# Altium schematic sheet OUTPUT.SchDoc
size A4; SheetNumber: 3; SheetTotal: 9
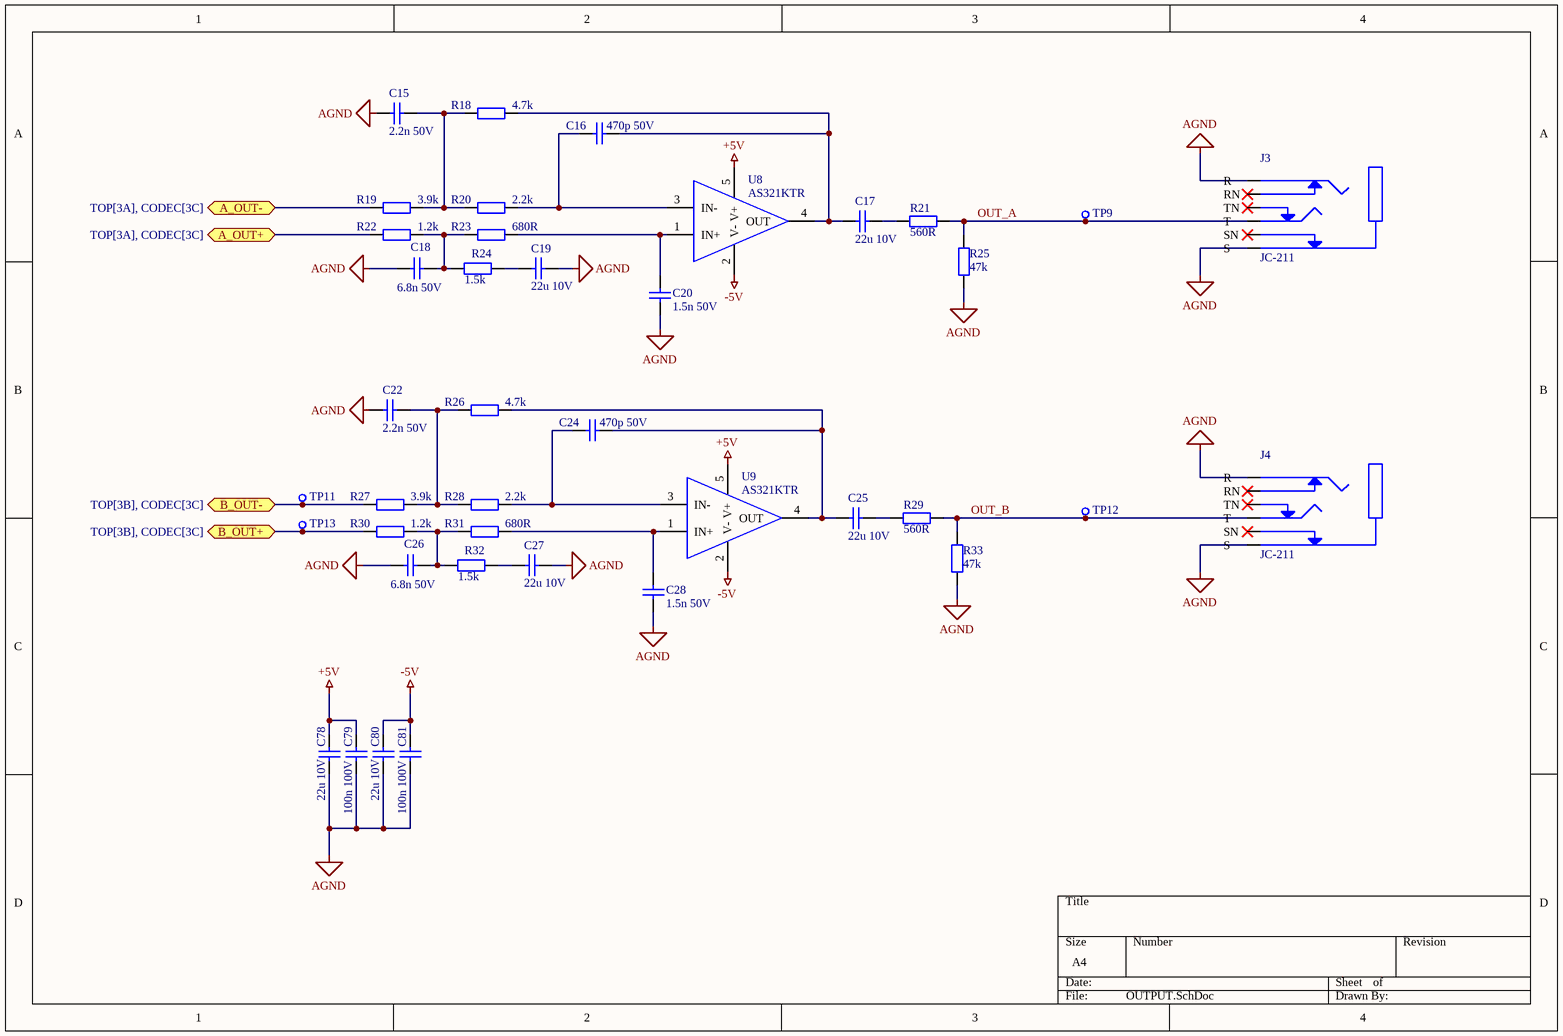
[diagram p0: OUTPUT.SchDoc]

## Parts
C15  2.2n 50V  [CAPACITOR 0805]
C16  470p 50V  [CAPACITOR 0805]
C17  22u 10V  [CAPACITOR 0805]
C18  6.8n 50V  [CAPACITOR 0805]
C19  22u 10V  [CAPACITOR 0805]
C20  1.5n 50V  [CAPACITOR 0805]
C22  2.2n 50V  [CAPACITOR 0805]
C24  470p 50V  [CAPACITOR 0805]
C25  22u 10V  [CAPACITOR 0805]
C26  6.8n 50V  [CAPACITOR 0805]
C27  22u 10V  [CAPACITOR 0805]
C28  1.5n 50V  [CAPACITOR 0805]
C78  22u 10V  [CAPACITOR 0805]
C79  100n 100V  [CAPACITOR 0805]
C80  22u 10V  [CAPACITOR 0805]
C81  100n 100V  [CAPACITOR 0805]
J3  JC-211  [AMPHENOL ACJM-MHDR]
J4  JC-211  [AMPHENOL ACJM-MHDR]
R18  4.7k  [RESISTOR 0805]
R19  3.9k  [RESISTOR 0805]
R20  2.2k  [RESISTOR 0805]
R21  560R  [RESISTOR 0805]
R22  1.2k  [RESISTOR 0805]
R23  680R  [RESISTOR 0805]
R24  1.5k  [RESISTOR 0805]
R25  47k  [RESISTOR 0805]
R26  4.7k  [RESISTOR 0805]
R27  3.9k  [RESISTOR 0805]
R28  2.2k  [RESISTOR 0805]
R29  560R  [RESISTOR 0805]
R30  1.2k  [RESISTOR 0805]
R31  680R  [RESISTOR 0805]
R32  1.5k  [RESISTOR 0805]
R33  47k  [RESISTOR 0805]
TP9  1mm  [TEST POINT 1MM]  (value not drawn)
TP11  1mm  [TEST POINT 1MM]  (value not drawn)
TP12  1mm  [TEST POINT 1MM]  (value not drawn)
TP13  1mm  [TEST POINT 1MM]  (value not drawn)
U8  AS321KTR  [SOT23-5]
U9  AS321KTR  [SOT23-5]

## Ports
A_OUT+ (bidir, see TOP[3A], CODEC[3C]), A_OUT- (bidir, see TOP[3A], CODEC[3C]), B_OUT+ (bidir, see TOP[3B], CODEC[3C]), B_OUT- (bidir, see TOP[3B], CODEC[3C])

## Nets
+5V: C78.2 C79.2 U8.5(V+) U9.5(V+)
-5V: C80.2 C81.2 U8.2(V-) U9.2(V-)
AGND: C15.1 C18.1 C19.2 C20.1 C22.1 C26.1 C27.2 C28.1 C78.1 C79.1 C80.1 C81.1 J3.1(S) J3.2(R) J4.1(S) J4.2(R) R25.1 R33.1
A_OUT+: R22.1 ; port A_OUT+
A_OUT-: R19.1 ; port A_OUT-
B_OUT+: R30.1 TP13.1 ; port B_OUT+
B_OUT-: R27.1 TP11.1 ; port B_OUT-
OUT_A: J3.3(T) R21.2 R25.2 TP9.1
OUT_B: J4.3(T) R29.2 R33.2 TP12.1
NetC15_2: C15.2 R18.1 R19.2 R20.1
NetC16_1: C16.1 R20.2 U8.3(IN-)
NetC16_2: C16.2 C17.1 R18.2 U8.4(OUT)
NetC17_2: C17.2 R21.1
NetC18_2: C18.2 R22.2 R23.1 R24.1
NetC19_1: C19.1 R24.2
NetC20_2: C20.2 R23.2 U8.1(IN+)
NetC22_2: C22.2 R26.1 R27.2 R28.1
NetC24_1: C24.1 R28.2 U9.3(IN-)
NetC24_2: C24.2 C25.1 R26.2 U9.4(OUT)
NetC25_2: C25.2 R29.1
NetC26_2: C26.2 R30.2 R31.1 R32.1
NetC27_1: C27.1 R32.2
NetC28_2: C28.2 R31.2 U9.1(IN+)

Not connected (* = marked no-connect by the designer): J3 4(TN)* 5(RN)* 6(SN)*; J4 4(TN)* 5(RN)* 6(SN)*

## Library data of the parts
C15 C22 = Capacitor 2.2n 50V ±2% X7R 0805: Capacitor: ceramic; MLCC; 2.2nF; 50V; X7R; ±10%; SMD; 0805; Manufacturer: KYOCERA AVX; Manufacturer Part Number: 08055C222KAT2A; ComponentLink1Description: Datasheet; ComponentLink1URL: https://www.tme.eu/Document/78f46414e6dac38b7cca12338ea208b0/X7RDielectric.pdf; Price 10pcs [$]: 0.0680; Supplier: TME
C16 C24 = Capacitor 470p 50V 10% X7R 0805: Capacitor: ceramic; MLCC; 470pF; 50V; X7R; ±10%; SMD; 0805; Manufacturer: KEMET; Manufacturer Part Number: C0805C471K5RAC; ComponentLink1Description: Datasheet; ComponentLink1URL: https://www.tme.eu/Document/8b10290897269af8f8558c697aa8fd11/C0805C471K5RACTU.pdf; Footprint: Capacitor 0805; Price 10pcs [$]: 0.01970; Supplier: TME
C17 C19 C25 C27 C78 C80 = Capacitor 22u 10V 20% X5R 0805: Capacitor: ceramic; 22uF; 10V; X5R; ±20%; SMD; 0805; Manufacturer: SAMSUNG; Manufacturer Part Number: CL21A226MPQNNNE; ComponentLink1Description: Datasheet; ComponentLink1URL: https://www.tme.eu/Document/7da762c1dbaf553c64ad9c40d3603826/mlcc_samsung.pdf; Footprint: Capacitor 0805; Price 10pcs [$]: 0.0490; Supplier: TME
C18 C26 = Capacitor 6.8n 50V ±2% X7R 0805: Capacitor: ceramic; MLCC; 6.8nF; 50V; X7R; ±10%; SMD; 0805; Manufacturer: KYOCERA AVX; Manufacturer Part Number: 08055C682KAT2A; ComponentLink1Description: Datasheet; ComponentLink1URL: https://www.tme.eu/Document/78f46414e6dac38b7cca12338ea208b0/X7RDielectric.pdf; Price 10pcs [$]: 0.0680; Supplier: TME
C20 C28 = Capacitor 1.5n 50V ±2% X7R 0805: Capacitor: ceramic; MLCC; 1.5nF; 50V; X7R; ±10%; SMD; 0805; Manufacturer: KYOCERA AVX; Manufacturer Part Number: 08055C152KAT2A; ComponentLink1Description: Datasheet; ComponentLink1URL: https://www.tme.eu/Document/78f46414e6dac38b7cca12338ea208b0/X7RDielectric.pdf; Price 10pcs [$]: 0.0680; Supplier: TME
C79 C81 = Capacitor 100n 100V 10% X7R 0805: Capacitor: ceramic; MLCC; 100nF; 100V; X7R; ±10%; SMD; 0805; Manufacturer: YAGEO; Manufacturer Part Number: CC0805KKX7R0BB104; ComponentLink1Description: Datasheet; ComponentLink1URL: https://www.tme.eu/Document/fbb9415081fcefba62c0f8bbf5b21210/UPY-GPHC_X7R_6.3V-to-50V_20.pdf; Footprint: Capacitor 0805; Price 10pcs [$]: 0.0770; Supplier: TME
J3 J4 = Mechanical Jack 6.3mm Socket PCB THT JC-211: Socket; Jack 6,3mm; female; mono; ways: 2; for panel mounting; THT; Manufacturer: NINIGI; ComponentLink1Description: Datasheet; ComponentLink1URL: https://www.tme.eu/html/EN/connector-jack-6-3mm-socket/ramka_770_EN_pelny.html; Manufacturer Part Number: JC-211; Price 10pcs [$]: 0.581; Supplier: TME
R18 R26 = Resistor 4.7k 1% 1/8W 0805: Resistor: thick film; SMD; 0805; 4.7kΩ; 0.125W; ±1%; -55÷155°C; Manufacturer: Yageo; Manufacturer Part Number: RC0805FR-074K7; ComponentLink1Description: Datasheet; ComponentLink1URL: https://www.tme.eu/Document/7b8fed8c112f8a94930279c22c957f7f/rc0805yageo.pdf; Price 10pcs [$]: 0.02250; Supplier: TME
R19 R27 = Resistor 3.9k 1% 1/8W 0805: Resistor: thick film; SMD; 0805; 3.9kkΩ; 0.125W; ±1%; -55÷155°C; Manufacturer: Yageo; Manufacturer Part Number: RC0805FR-073K9; ComponentLink1Description: Datasheet; ComponentLink1URL: https://www.tme.eu/Document/7b8fed8c112f8a94930279c22c957f7f/rc0805yageo.pdf; Price 10pcs [$]: 0.02250; Supplier: TME
R20 R28 = Resistor 2.2k 1% 1/8W 0805: Resistor: thick film; SMD; 0805; 2.2kΩ; 0.125W; ±1%; -55÷155°C; Manufacturer: Yageo; Manufacturer Part Number: RC0805FR-072K2; ComponentLink1Description: Datasheet; ComponentLink1URL: https://www.tme.eu/Document/7b8fed8c112f8a94930279c22c957f7f/rc0805yageo.pdf; Price 10pcs [$]: 0.02250; Supplier: TME
R21 R29 = Resistor 560R 1% 1/8W 0805: Resistor: thick film; SMD; 0805; 560Ω; 0.125W; ±1%; -55÷155°C; Manufacturer: Yageo; Manufacturer Part Number: RC0805FR-07560R; ComponentLink1Description: Datasheet; ComponentLink1URL: https://www.tme.eu/Document/7b8fed8c112f8a94930279c22c957f7f/rc0805yageo.pdf; Footprint: Resistor 0805; Price 10pcs [$]: 0.023; Supplier: TME
R22 R30 = Resistor 1.2k 1% 1/8W 0805: Resistor: thick film; SMD; 0805; 1.2kΩ; 0.125W; ±1%; -55÷155°C; Manufacturer: Yageo; Manufacturer Part Number: RC0805FR-071K2; ComponentLink1Description: Datasheet; ComponentLink1URL: https://www.tme.eu/Document/7b8fed8c112f8a94930279c22c957f7f/rc0805yageo.pdf; Price 10pcs [$]: 0.02250; Supplier: TME
R23 R31 = Resistor 680R 1% 1/8W 0805: Resistor: thick film; SMD; 0805; 680Ω; 0.125W; ±1%; -55÷155°C; Manufacturer: Yageo; Manufacturer Part Number: RC0805FR-07680R; ComponentLink1Description: Datasheet; ComponentLink1URL: https://www.tme.eu/Document/7b8fed8c112f8a94930279c22c957f7f/rc0805yageo.pdf; Footprint: Resistor 0805; Price 10pcs [$]: 0.023; Supplier: TME
R24 R32 = Resistor 1.5k 1% 1/8W 0805: Resistor: thick film; SMD; 0805; 1.5kΩ; 0.125W; ±1%; -55÷155°C; Manufacturer: Yageo; Manufacturer Part Number: RC0805FR-071K5; ComponentLink1Description: Datasheet; ComponentLink1URL: https://www.tme.eu/Document/7b8fed8c112f8a94930279c22c957f7f/rc0805yageo.pdf; Price 10pcs [$]: 0.02250; Supplier: TME
R25 R33 = Resistor 47k 1% 1/8W 0805: Resistor: thick film; SMD; 0805; 47kΩ; 0.125W; ±1%; -55÷155°C; Manufacturer: Yageo; Manufacturer Part Number: RC0805FR-0747K; ComponentLink1Description: Datasheet; ComponentLink1URL: https://www.tme.eu/Document/7b8fed8c112f8a94930279c22c957f7f/rc0805yageo.pdf; Price 10pcs [$]: 0.04450; Supplier: TME
TP9 TP11-TP13 = Mechanical Test Point 1mm: Tesp Point 1mm; ComponentLink1Description: Datasheet; ComponentLink1URL: -; Manufacturer: -; Manufacturer Part Number: -; Footprint: -; Price 10pcs [$]: -; Supplier: -
U8 U9 = IC Op-Amp Single AS321KTR SOT23-5: IC: operational amplifier; 3÷36V; Ch: 1; SOT23-5; reel,tape; Manufacturer: DIODES INCORPORATED; Manufacturer Part Number: AS321KTR-G1; ComponentLink1Description: Datasheet; ComponentLink1URL: https://www.tme.eu/Document/ff04728045a484fb1c57ffb6d73e1bf1/AS321.pdf; Footprint: SOIC-8; Price 10pcs [$]: 0.214; Supplier: TME